# Altium schematic sheet core.SchDoc
size A4
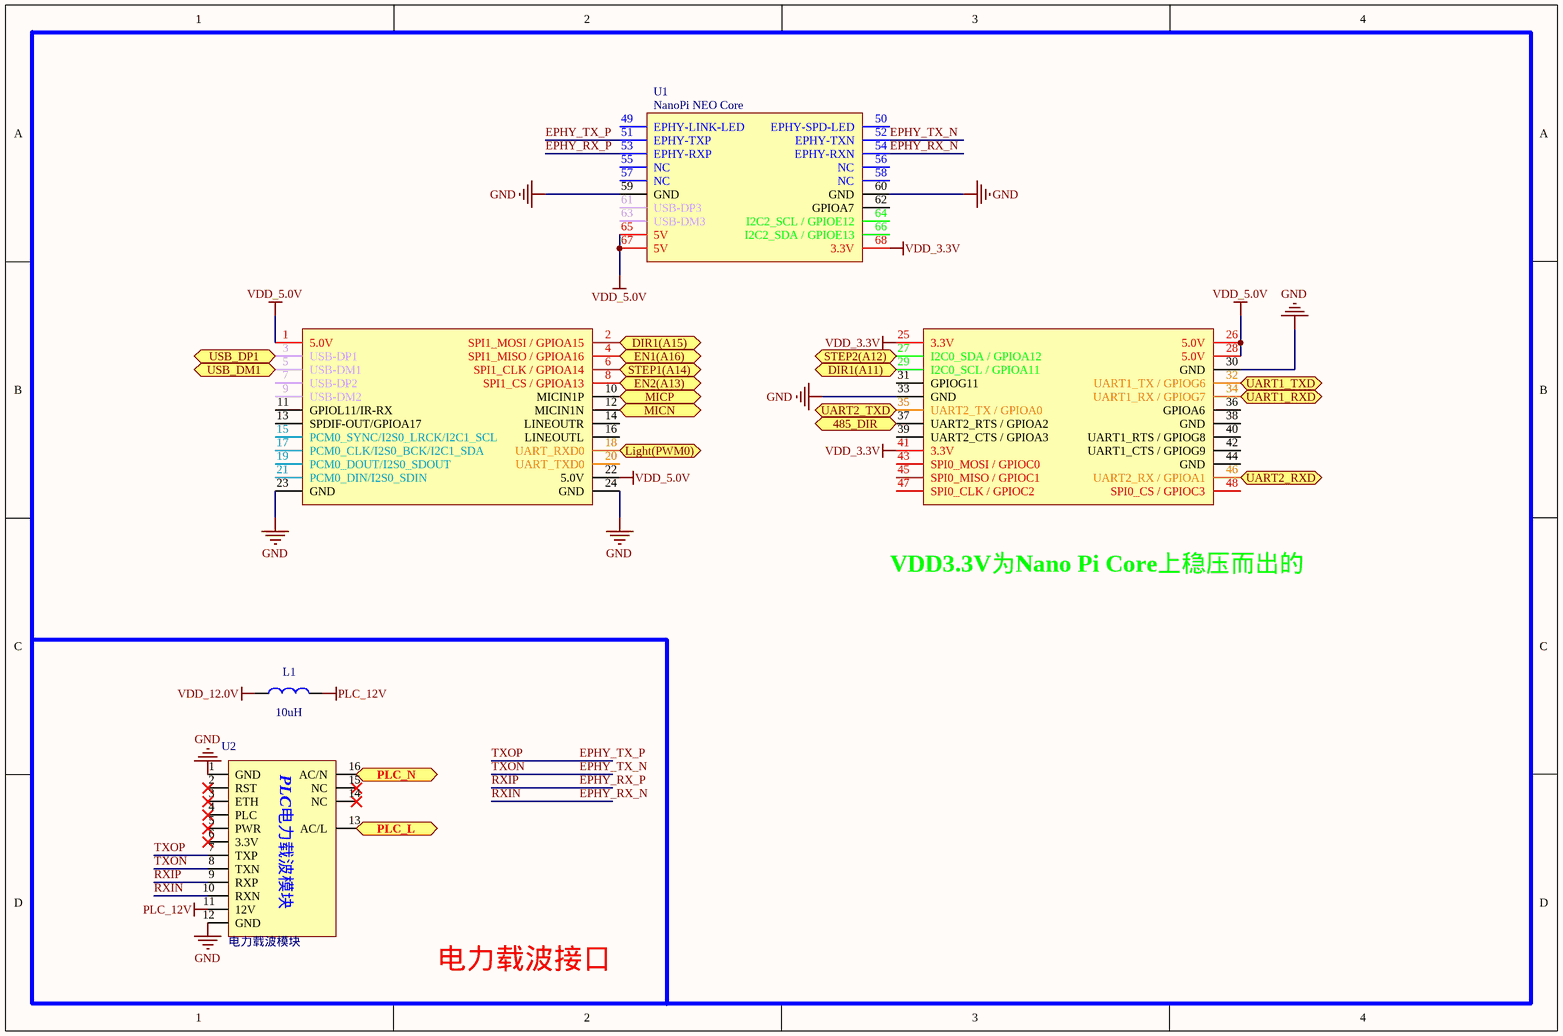
[diagram p0: core.SchDoc]

## Parts
L1  10uH  [1206L]
U1  NanoPi NEO Core  [NanoPi NEO Core]
U2  电力载波模块  [电力载波模块6410(贴片版)]

## Ports
485_DIR, DIR1(A11), DIR1(A15), EN1(A16), EN2(A13), Light(PWM0), MICN, MICP, PLC_L, PLC_N, STEP1(A14), STEP2(A12), UART1_RXD, UART1_TXD, UART2_RXD, UART2_TXD, USB_DM1, USB_DP1

## Nets
GND: U1.23(GND) U1.24(GND) U1.30(GND) U1.33(GND) U1.59(GND) U1.60(GND) U2.1(GND) U2.12(GND)
PLC_12V: L1.2 U2.11(12V)
VDD_3.3V: U1.25(3.3V) U1.41(3.3V) U1.68(3.3V)
VDD_5.0V: U1.1(5.0V) U1.22(5.0V) U1.26(5.0V) U1.28(5.0V) U1.65(5V) U1.67(5V)
VDD_12.0V: L1.1
485_DIR: U1.37(UART2_RTS_/_GPIOA2) ; port 485_DIR
DIR1(A11): U1.29(I2C0_SCL_/_GPIOA11) ; port DIR1(A11)
DIR1(A15): U1.2(SPI1_MOSI_/_GPIOA15) ; port DIR1(A15)
EN1(A16): U1.4(SPI1_MISO_/_GPIOA16) ; port EN1(A16)
EN2(A13): U1.8(SPI1_CS_/_GPIOA13) ; port EN2(A13)
EPHY_RX_N: U1.54(EPHY-RXN) U2.10(RXN)  [also labelled RXIN]
EPHY_RX_P: U1.53(EPHY-RXP) U2.9(RXP)  [also labelled RXIP]
EPHY_TX_N: U1.52(EPHY-TXN) U2.8(TXN)  [also labelled TXON]
EPHY_TX_P: U1.51(EPHY-TXP) U2.7(TXP)  [also labelled TXOP]
Light(PWM0): U1.18(UART_RXD0) ; port Light(PWM0)
MICN: U1.12(MICIN1N) ; port MICN
MICP: U1.10(MICIN1P) ; port MICP
PLC_L: U2.13(AC/L) ; port PLC_L
PLC_N: U2.16(AC/N) ; port PLC_N
STEP1(A14): U1.6(SPI1_CLK_/_GPIOA14) ; port STEP1(A14)
STEP2(A12): U1.27(I2C0_SDA_/_GPIOA12) ; port STEP2(A12)
UART1_RXD: U1.34(UART1_RX_/_GPIOG7) ; port UART1_RXD
UART1_TXD: U1.32(UART1_TX_/_GPIOG6) ; port UART1_TXD
UART2_RXD: U1.46(UART2_RX_/_GPIOA1) ; port UART2_RXD
UART2_TXD: U1.35(UART2_TX_/_GPIOA0) ; port UART2_TXD
USB_DM1: U1.5(USB-DM1) ; port USB_DM1
USB_DP1: U1.3(USB-DP1) ; port USB_DP1

Not connected (* = marked no-connect by the designer): U1 7(USB-DP2) 9(USB-DM2) 11(GPIOL11/IR-RX) 13(SPDIF-OUT/GPIOA17) 14(LINEOUTR) 15(PCM0_SYNC/I2S0_LRCK/I2C1_SCL) 16(LINEOUTL) 17(PCM0_CLK/I2S0_BCK/I2C1_SDA) 19(PCM0_DOUT/I2S0_SDOUT) 20(UART_TXD0) 21(PCM0_DIN/I2S0_SDIN) 31(GPIOG11) 36(GPIOA6) 38(GND) 39(UART2_CTS_/_GPIOA3) 40(UART1_RTS_/_GPIOG8) 42(UART1_CTS_/_GPIOG9) 43(SPI0_MOSI_/_GPIOC0) 44(GND) 45(SPI0_MISO_/_GPIOC1) 47(SPI0_CLK_/_GPIOC2) 48(SPI0_CS_/_GPIOC3) 49(EPHY-LINK-LED) 50(EPHY-SPD-LED) 55(NC) 56(NC) 57(NC) 58(NC) 61(USB-DP3) 62(GPIOA7) 63(USB-DM3) 64(I2C2_SCL_/_GPIOE12) 66(I2C2_SDA_/_GPIOE13); U2 2(RST)* 3(ETH)* 4(PLC)* 5(PWR)* 6(3.3V)* 14(NC)* 15(NC)*

## Notes on the sheet
- VDD3.3V为Nano Pi Core上稳压而出的
- 电力载波接口
- (in symbol 电力载波模块6410) PLC电力载波模块

## Library data of the parts
L1 = L: 电感
U2 = 电力载波模块6410